# Altium project Boost_converter.PrjPcb
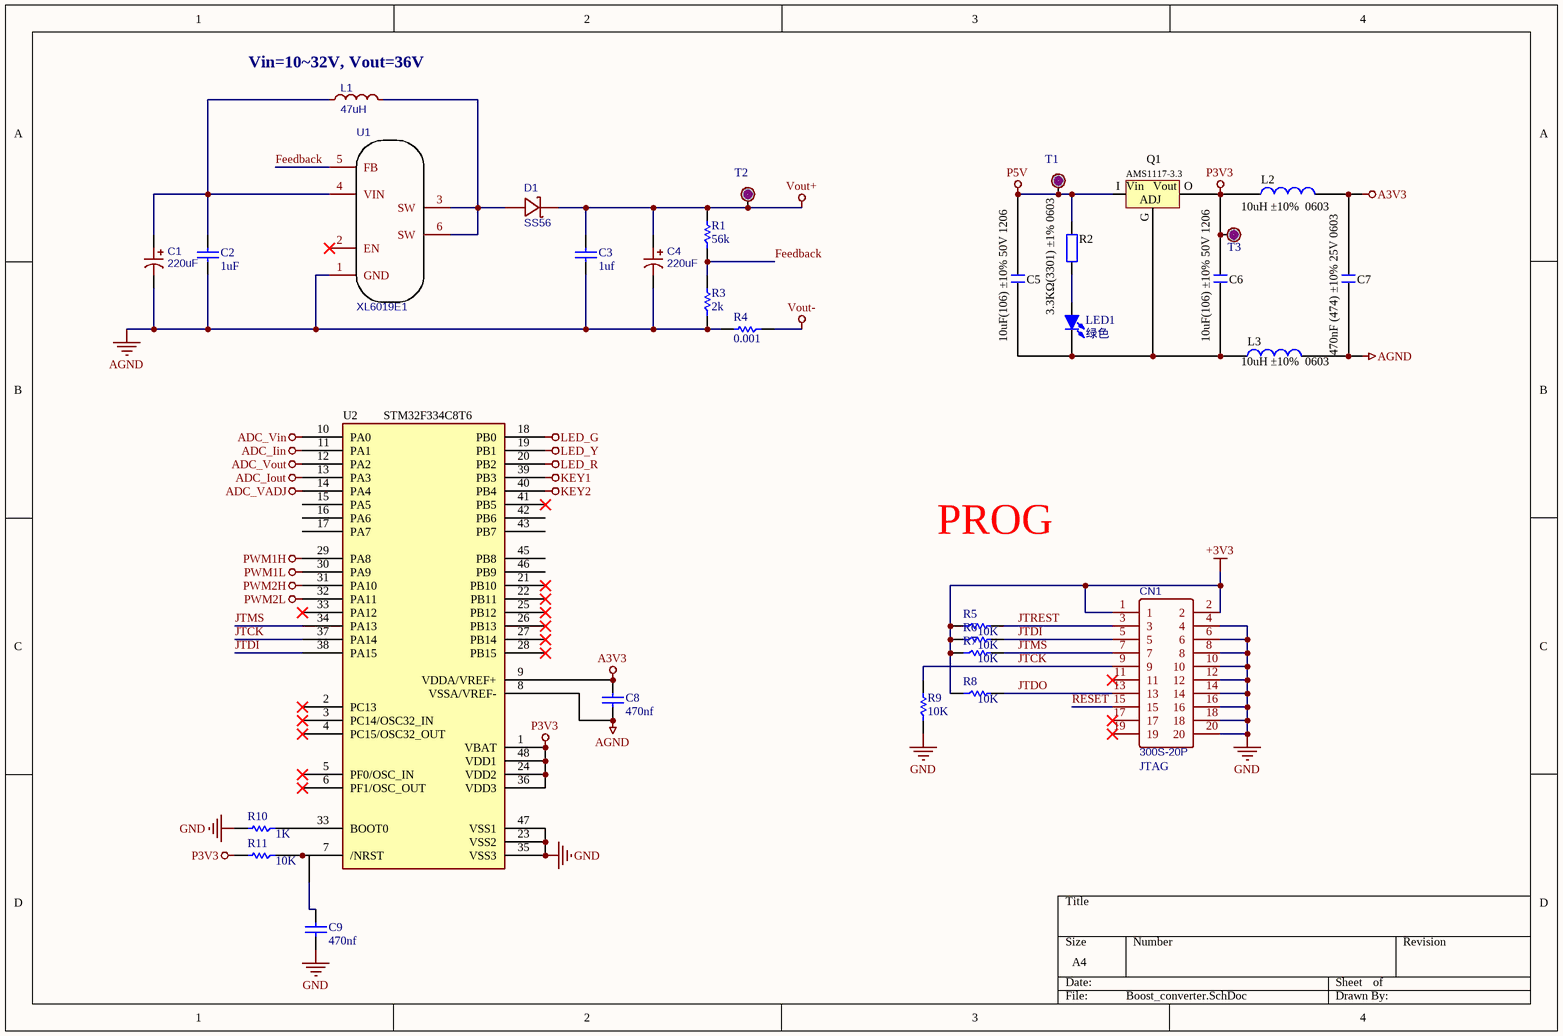
[diagram p0: Boost_converter.SchDoc]
1 sheet, 32 parts. Net scope: global (net labels, ports and power ports of the same name join across sheets).

## Sheet Boost_converter.SchDoc
size A4; SheetNumber: 1; SheetTotal: 1

### Parts
C1  220uF  [CAP-SMD_BD10.0-L10.3-W10.3-LS11.0-FD]
C2  1uF  [0805C]
C3  1uf  [C0805_L]
C4  220uF  [CAP-SMD_BD10.0-L10.3-W10.3-LS11.0-FD]
C5  10uF(106) ±10% 50V 1206  [C 1206_M]
C6  10uF(106) ±10% 50V 1206  [C 1206_M]
C7  470nF (474) ±10% 25V 0603  [C 0603_L]
C8  470nf  [0805C]
C9  470nf  [0805C]
CN1  300S-20P  [CONN-TH_300S-20P]
D1  SS56  [SMA_L4.3-W2.6-LS5.2-RD]
L1  47uH  [IND-SMD_L12.6-W12.6_MCF-13XX]
L2  10uH ±10%  0603  [L 0603]
L3  10uH ±10%  0603  [L 0603]
LED1  绿色  [LED 0603R]
Q1  AMS1117-3.3  [SOT-223]
R1  56k  [0805]
R2  3.3KΩ(3301) ±1% 0603  [R 0603_L]
R3  2k  [0805]
R4  0.001  [0805]
R5  10K  [0805]
R6  10K  [0805]
R7  10K  [0805]
R8  10K  [0805]
R9  10K  [0805]
R10  1K  [0805]
R11  10K  [0805]
T1  TestP  [TestP]  (value not drawn)
T2  TestP  [TestP]  (value not drawn)
T3  TestP  [TestP]  (value not drawn)
U1  XL6019E1  [TO-263-5_L10.2-W9.9-P1.70-LS14.4-TL]
U2  STM32F334C8T6  [LQFP48-7*7]

### Nets
+3V3: CN1.1 CN1.2 R5.1 R6.1 R7.1 R8.1
A3V3: C7.1 C8.1 L2.2 U2.9(VDDA/VREF+)
ADC_Iin: U2.11(PA1)
ADC_Iout: U2.13(PA3)
ADC_VADJ: U2.14(PA4)
ADC_Vin: U2.10(PA0)
ADC_Vout: U2.12(PA2)
AGND: C1.2 C2.2 C3.1 C4.2 C7.2 C8.2 L3.2 R3.1 R4.2 U1.1(GND) U2.8(VSSA/VREF-)
GND: C9.2 CN1.4 CN1.6 CN1.8 CN1.10 CN1.12 CN1.14 CN1.16 CN1.18 CN1.20 R9.1 R10.2 U2.23(VSS2) U2.35(VSS3) U2.47(VSS1)
KEY1: U2.39(PB3)
KEY2: U2.40(PB4)
LED_G: U2.18(PB0)
LED_R: U2.20(PB2)
LED_Y: U2.19(PB1)
P3V3: C6.2 L2.1 Q1.O(OUT) R11.2 T3.0 U2.1(VBAT) U2.24(VDD2) U2.36(VDD3) U2.48(VDD1)
P5V: C5.2 Q1.I(IN) R2.1 T1.0
PWM1H: U2.29(PA8)
PWM1L: U2.30(PA9)
PWM2H: U2.31(PA10)
PWM2L: U2.32(PA11)
Vout+: C3.2 C4.1 D1.1(K) R1.2 T2.0
Vout-: R4.1
Feedback: R1.1 R3.2 U1.5(FB)
JTCK: CN1.9 R9.2 U2.37(PA14)
JTDI: CN1.5 R6.2 U2.38(PA15)
JTDO: CN1.13 R8.2
JTMS: CN1.7 R7.2 U2.34(PA13)
JTREST: CN1.3 R5.2
RESET: CN1.15
NetC1_1: C1.1 C2.1 L1.1 U1.4(VIN)
NetC5_1: C5.1 C6.1 L3.1 LED1.2(K) Q1.G
NetC9_1: C9.1 R11.1 U2.7(/NRST)
NetD1_2: D1.2(A) L1.2 U1.3(SW) U1.6(SW)
NetLED1_1: LED1.1(A) R2.2
NetR10_1: R10.1 U2.33(PA12)

Not connected (* = marked no-connect by the designer): CN1 11* 17* 19*; U1 2(EN)*; U2 2(PC13)* 3(PC14/OSC32_IN)* 4(PC15/OSC32_OUT)* 5(PF0/OSC_IN)* 6(PF1/OSC_OUT)* 15(PA5) 16(PA6) 17(PA7) 21(PB10)* 22(PB11)* 25(PB12)* 26(PB13)* 27(PB14)* 28(PB15)* 41(PB5)* 42(PB6) 43(PB7) 45(PB8) 46(PB9)

### Notes on the sheet
- (near L1) Vin=10~32V, Vout=36V
- PROG
- (near CN1) JTAG
- (in symbol NCP1117ST50T3G) Vin; Vout; ADJ

### Library data of the parts
C1 C4 = 220uF: BOM_Manufacturer: KNSCHA(科尼盛); BOM_Manufacturer Part: RVT220UF50V67RV0021; nameAlias: Capacitance; Contributor: LCSC; BOM_Supplier: LCSC; BOM_Supplier Part: C2887271; BOM_JLCPCB Part Class: Extended Part; spicePre: C; spiceSymbolName: RVT220UF50V67RV0021
C2 = C_1uf: Capacitor; Reviewed by: RM - 2018/08/05; Revision: July-2002: Re-released for DXP Platform.; Supplier 1: *; Supplier Part Number 1: *; Value: 1uF
C3 = C: 贴片电容/MLCC电容; BOM名称: 无极性贴片电容; 联系卖家，免费查找封装: 唯一出售店铺网址https://shop463601444.taobao.com
C5-C7 = C: 贴片电容; BOM名称: 无极性贴片电容; 淘宝ID: 封装库来自淘宝 ID：黄晶宝石; 联系售后，技术支持: https://shop463601444.taobao.com; 唯一出售店铺网址: https://shop463601444.taobao.com
C8 C9 = C_330uf: Capacitor; Reviewed by: RM - 2018/08/05; Revision: July-2002: Re-released for DXP Platform.; Supplier 1: *; Supplier Part Number 1: *; Value: 470nf
CN1 = 300S-20P: BOM_Manufacturer: Shenzhen Cankemeng; Contributor: LCSC; BOM_Supplier: LCSC; BOM_Supplier Part: C132442; BOM_Manufacturer Part: -; BOM_JLCPCB Part Class: Extended Part; spicePre: C; spiceSymbolName: 300S-20P
D1 = SS56: BOM_Manufacturer: MDD; BOM_Supplier: LCSC; BOM_Manufacturer Part: SS56; BOM_Supplier Part: C65009; BOM_JLCPCB Part Class: Extended Part; spicePre: D; spiceSymbolName: SS56
L1 = 47uH: BOM_Manufacturer: YJYCOIN; BOM_Manufacturer Part: YSPI1365-470M; nameAlias: Inductance; Contributor: LCSC; BOM_Supplier: LCSC; BOM_Supplier Part: C497913; BOM_JLCPCB Part Class: Extended Part; spicePre: L; spiceSymbolName: YSPI1365-470M
L2 L3 = L: 小功率贴片电感; 淘宝ID: 封装库来自淘宝 ID：黄晶宝石; 封装库来自淘宝卖家 ID：黄晶宝石: 其他店铺购入均为盗版，不享受售后技术支持服务，请立即申请退款; BOM名称: 小功率贴片电感; 联系售后: https://shop463601444.taobao.com
LED1 = LED-SMD: 贴片LED; 版权归属: 封装库来自淘宝 ID：黄晶宝石; BOM名称: 贴片LED; 学习资源: https://shop463601444.taobao.com
Q1 = NCP1117ST50T3G
R1 R4 = R_12k: Resistor; Reviewed by: RM - 2018/08/05; Supplier 1: *; Suppler Part Number 1: *
  R1: Value: 56k
  R4: Value: 0.001
R2 = R: 贴片电阻; 版权归属: 来自淘宝 ID：黄晶宝石; 封装库来自淘宝卖家 ID：黄晶宝石: 其他店铺购入均为盗版，不享受售后技术支持服务，请立即申请退款; BOM名称: 贴片电阻; 联系售后: https://shop463601444.taobao.com
R3 = R_2k: Resistor; Reviewed by: RM - 2018/08/05; Supplier 1: *; Suppler Part Number 1: *; Value: 2k
R5-R9 = R_10k: Resistor; Reviewed by: RM - 2018/08/05; Supplier 1: *; Suppler Part Number 1: *; Value: 10K
R10 R11 = R_1k: Resistor; Reviewed by: RM - 2018/08/05; Supplier 1: *; Suppler Part Number 1: *
  R10: Value: 1K
  R11: Value: 10K
U1 = XL6019E1: BOM_Manufacturer: XLSEMI; BOM_Supplier: LCSC; BOM_Manufacturer Part: XL6019E1; BOM_Supplier Part: C73018; BOM_JLCPCB Part Class: Extended Part; spicePre: U; spiceSymbolName: XL6019E1